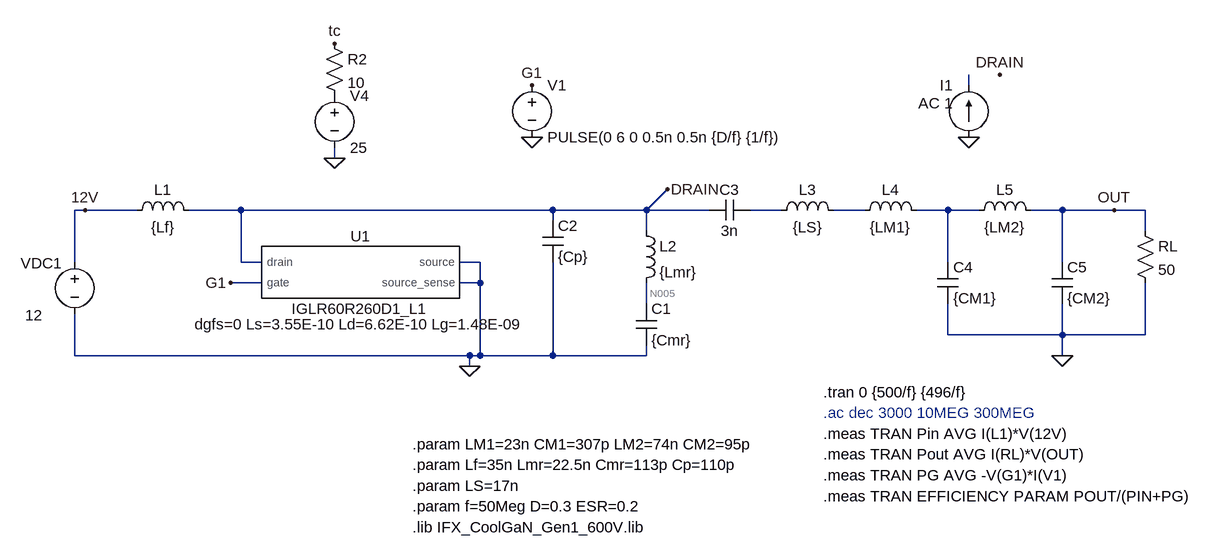
[diagram p0: schematic phi_2_50MHz_IGLR60R260D1.asc]
phi_2_50MHz_IGLR60R260D1.asc, the LTspice schematic file:
Version 4
SHEET 1 1068 680
WIRE 416 -176 416 -192
WIRE -560 -64 -560 -80
WIRE -944 16 -960 16
WIRE -864 16 -944 16
WIRE -704 16 -784 16
WIRE -224 16 -704 16
WIRE -80 16 -48 -16
WIRE -80 16 -224 16
WIRE 16 16 -80 16
WIRE 128 16 80 16
WIRE 256 16 208 16
WIRE 384 16 336 16
WIRE 432 16 384 16
WIRE 560 16 512 16
WIRE 640 16 560 16
WIRE 688 16 640 16
WIRE -224 32 -224 16
WIRE -80 48 -80 16
WIRE 688 48 688 16
WIRE -960 96 -960 16
WIRE -704 96 -704 16
WIRE -672 96 -704 96
WIRE -336 96 -368 96
WIRE 384 96 384 16
WIRE 560 96 560 16
WIRE -672 128 -720 128
WIRE -336 128 -336 96
WIRE -336 128 -368 128
WIRE -80 160 -80 128
WIRE 384 208 384 160
WIRE 560 208 560 160
WIRE 560 208 384 208
WIRE 688 208 688 128
WIRE 688 208 560 208
WIRE -960 240 -960 176
WIRE -352 240 -960 240
WIRE -336 240 -336 128
WIRE -336 240 -352 240
WIRE -224 240 -224 96
WIRE -224 240 -336 240
WIRE -80 240 -80 224
WIRE -80 240 -224 240
WIRE 560 240 560 208
WIRE -352 256 -352 240
FLAG -944 16 12V
FLAG -256 -176 G1
FLAG -256 -96 0
FLAG 640 16 OUT
FLAG 416 -96 0
FLAG 560 240 0
FLAG -48 -16 DRAIN
FLAG -352 256 0
FLAG -720 128 G1
FLAG -560 -64 0
FLAG -560 -240 tc
FLAG 464 -192 DRAIN
SYMBOL voltage -960 80 R0
WINDOW 123 0 0 Left 0
WINDOW 39 0 0 Left 0
WINDOW 0 -83 18 Left 2
WINDOW 3 -76 98 Left 2
SYMATTR InstName VDC1
SYMATTR Value 12
SYMBOL cap -96 224 M180
WINDOW 0 24 56 Left 2
WINDOW 3 24 8 Left 2
SYMATTR InstName C1
SYMATTR Value {Cmr}
SYMBOL ind -880 32 R270
WINDOW 0 32 56 VTop 2
WINDOW 3 5 56 VBottom 2
SYMATTR InstName L1
SYMATTR Value {Lf}
SYMATTR SpiceLine Rser={ESR}
SYMBOL ind -96 32 R0
SYMATTR InstName L2
SYMATTR Value {Lmr}
SYMATTR SpiceLine Rser={ESR}
SYMBOL cap -240 32 R0
SYMATTR InstName C2
SYMATTR Value {Cp}
SYMBOL voltage -256 -192 R0
WINDOW 123 0 0 Left 0
WINDOW 39 0 0 Left 0
SYMATTR InstName V1
SYMATTR Value PULSE(0 6 0 0.5n 0.5n {D/f} {1/f})
SYMBOL res 672 32 R0
SYMATTR InstName RL
SYMATTR Value 50
SYMBOL ind 112 32 R270
WINDOW 0 32 56 VTop 2
WINDOW 3 5 56 VBottom 2
SYMATTR InstName L3
SYMATTR Value {LS}
SYMATTR SpiceLine Rser={ESR}
SYMBOL cap 80 0 R90
WINDOW 0 0 32 VBottom 2
WINDOW 3 32 32 VTop 2
SYMATTR InstName C3
SYMATTR Value 3n
SYMBOL ind 240 32 R270
WINDOW 0 32 56 VTop 2
WINDOW 3 5 56 VBottom 2
SYMATTR InstName L4
SYMATTR Value {LM1}
SYMBOL cap 368 96 R0
SYMATTR InstName C4
SYMATTR Value {CM1}
SYMBOL ind 416 32 R270
WINDOW 0 32 56 VTop 2
WINDOW 3 5 56 VBottom 2
SYMATTR InstName L5
SYMATTR Value {LM2}
SYMATTR SpiceLine Rser={ESR}
SYMBOL cap 544 96 R0
SYMATTR InstName C5
SYMATTR Value {CM2}
SYMBOL voltage -560 -176 R0
SYMATTR InstName V4
SYMATTR Value 25
SYMBOL res -576 -256 R0
SYMATTR InstName R2
SYMATTR Value 10
SYMBOL current 416 -96 R180
WINDOW 0 24 80 Left 2
WINDOW 3 24 0 Left 2
WINDOW 123 24 52 Left 2
WINDOW 39 0 0 Left 0
SYMATTR InstName I1
SYMATTR Value ""
SYMATTR Value2 AC 1
SYMBOL IGLR60R260D1_L1 -528 112 R0
SYMATTR InstName U1
TEXT -440 472 Left 2 !.param f=50Meg D=0.3 ESR=0.2
TEXT -440 440 Left 2 !.param LS=17n
TEXT 192 296 Left 2 !.tran 0 {500/f} {496/f}
TEXT -440 504 Left 2 !.lib IFX_CoolGaN_Gen1_600V.lib
TEXT -440 408 Left 2 !.param Lf=35n Lmr=22.5n Cmr=113p Cp=110p
TEXT 192 328 Left 2 ;.ac dec 3000 10MEG 300MEG
TEXT -440 376 Left 2 !.param LM1=23n CM1=307p LM2=74n CM2=95p
TEXT 192 360 Left 2 !.meas TRAN Pin AVG I(L1)*V(12V)
TEXT 192 392 Left 2 !.meas TRAN Pout AVG I(RL)*V(OUT)
TEXT 192 424 Left 2 !.meas TRAN PG AVG -V(G1)*I(V1)
TEXT 192 456 Left 2 !.meas TRAN EFFICIENCY PARAM POUT/(PIN+PG)

The netlist it stands for:
* phi_2_50MHz_IGLR60R260D1.asc
VDC1 12V 0 12
C1 0 N005 {Cmr}
L1 12V DRAIN {Lf} Rser={ESR}
L2 DRAIN N005 {Lmr} Rser={ESR}
C2 DRAIN 0 {Cp}
V1 G1 0 PULSE(0 6 0 0.5n 0.5n {D/f} {1/f})
RL OUT 0 50
L3 N002 N003 {LS} Rser={ESR}
C3 N002 DRAIN 3n
L4 N003 N004 {LM1}
C4 N004 0 {CM1}
L5 N004 OUT {LM2} Rser={ESR}
C5 OUT 0 {CM2}
V4 P001 0 25
R2 tc P001 10
I1 0 N001 AC 1
XU1 DRAIN G1 0 0 IGLR60R260D1_L1 dgfs=0 Ls=3.55E-10 Ld=6.62E-10 Lg=1.48E-09  ; pins drain gate source source_sense
.param f=50Meg D=0.3 ESR=0.2
.param LS=17n
.tran 0 {500/f} {496/f}
.lib IFX_CoolGaN_Gen1_600V.lib
.param Lf=35n Lmr=22.5n Cmr=113p Cp=110p
* .ac dec 3000 10MEG 300MEG
.param LM1=23n CM1=307p LM2=74n CM2=95p
.meas TRAN Pin AVG I(L1)*V(12V)
.meas TRAN Pout AVG I(RL)*V(OUT)
.meas TRAN PG AVG -V(G1)*I(V1)
.meas TRAN EFFICIENCY PARAM POUT/(PIN+PG)
.lib C:\Users\linca\Desktop\SuPEr Lab\IMSSDC2024\SPICE\phi_2\IFX_CoolGaN_Gen1_600V.lib
.backanno
.end

* Results of the author's LTspice run, read from the files saved beside the schematic
* Operating Point, zero values left out:
*   V(12v) = 12 V
*   V(n005) = 12 V
*   V(drain) = 12 V
*   V(p001) = 25 V
*   V(tc) = 25 V
*   I(L1) = 2.886 nA
*   I(Vdc1) = -2.886 nA
*   Ix(u1:DRAIN) = 2.887 nA
*   Ix(u1:SOURCE) = -359.6 pA
*   Ix(u1:SOURCE_SENSE) = -120.4 pA
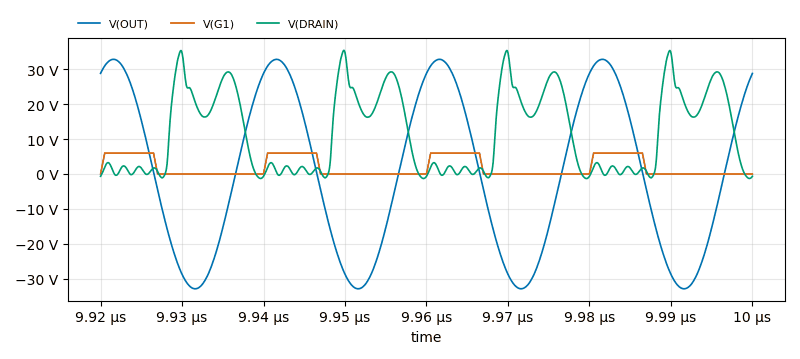
[diagram p1: Transient Analysis of phi_2_50MHz_IGLR60R260D1.asc, plotted from the saved traces]
* Transient Analysis, 1 run:
*   V(OUT): min -32.88 V, max 32.85 V, average -2.654 mV, rms 23.18 V, last 28.81 V
*   V(G1): min 0 V, max 6 V, average 1.95 V, rms 3.378 V, last 0 V
*   V(DRAIN): min -1.302 V, max 35.41 V, average 11.73 V, rms 16.63 V, last -647 mV
* From the log:
*   pin: AVG(i(l1)*v(12v))=15.7946 FROM 0 TO 8e-008
*   pout: AVG(i(rl)*v(out))=10.7456 FROM 0 TO 8e-008
*   pg: AVG(-v(g1)*i(v1))=0.947079 FROM 0 TO 8e-008
*   efficiency: pout/(pin+pg)=0.641844